# EAGLE design 1541-3d (EAGLE 6.6.0)
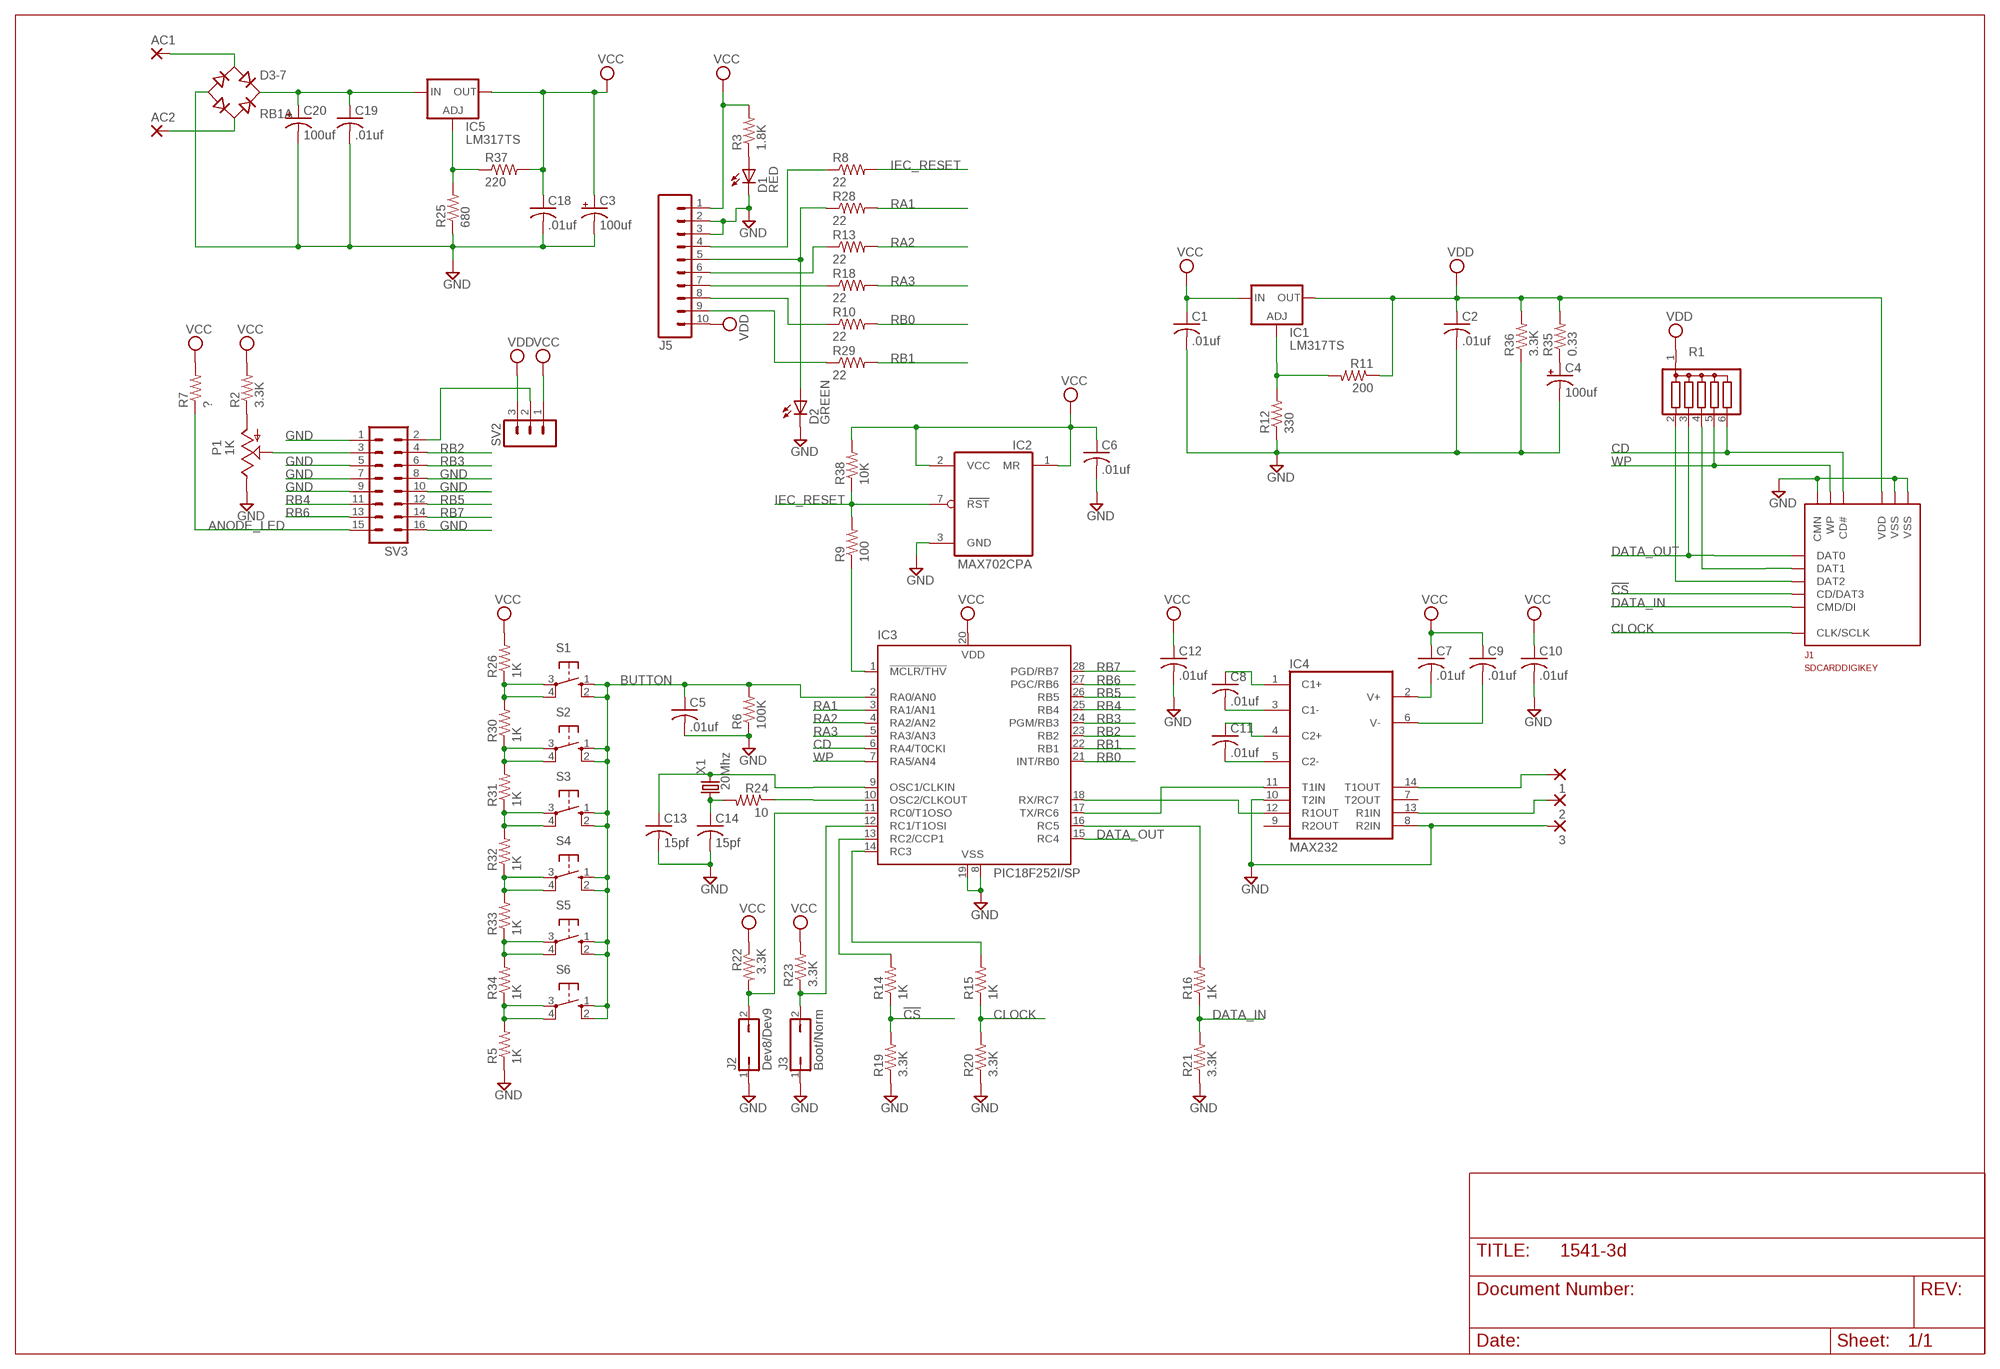
[diagram p0: schematic, sheet 1]

## Parts
1  2,15/1,0  [2,15/1,0]
2  2,15/1,0  [2,15/1,0]
3  2,15/1,0  [2,15/1,0]
AC1  2,15/1,0  [2,15/1,0]
AC2  2,15/1,0  [2,15/1,0]
C1  .01uf  C-US025-024X044  [C025-024X044]
C2  .01uf  C-US025-024X044  [C025-024X044]
C3  100uf  CPOL-USE2-5  [E2-5]
C4  100uf  CPOL-USE2-5  [E2-5]
C5  .01uf  C-US025-024X044  [C025-024X044]
C6  .01uf  C-US025-024X044  [C025-024X044]
C7  .01uf  C-US025-024X044  [C025-024X044]
C8  .01uf  C-US025-024X044  [C025-024X044]
C9  .01uf  C-US025-024X044  [C025-024X044]
C10  .01uf  C-US025-024X044  [C025-024X044]
C11  .01uf  C-US025-024X044  [C025-024X044]
C12  .01uf  C-US025-024X044  [C025-024X044]
C13  15pf  C-US025-024X044  [C025-024X044]
C14  15pf  C-US025-024X044  [C025-024X044]
C18  .01uf  C-US025-024X044  [C025-024X044]
C19  .01uf  C-US025-024X044  [C025-024X044]
C20  100uf  CPOL-USE2-5  [E2-5]
D1  RED  LED3MM  [LED3MM]
D2  GREEN  LED3MM  [LED3MM]
D3-7  RB1A  [RB1A]
IC1  LM317TS  [317TS]
IC2  MAX702CPA  [DIL08]
IC3  PIC18F252I/SP  PIC16F870P  [DIL28-3]
IC4  MAX232  [DIL16]
IC5  LM317TS  [317TS]
J1  SDCARDDIGIKEY  [WM24032]
J2  Dev8/Dev9  JP1Q  [JP1]
J3  Boot/Norm  JP1Q  [JP1]
J5  M10  [10P]
P1  1K  TRIM_US-LI10  [LI10]
R1  G05R  [SIL6]
R2  3.3K  R-US_0207/2V  [0207/2V]
R3  1.8K  R-US_0207/2V  [0207/2V]
R5  1K  R-US_0207/2V  [0207/2V]
R6  100K  R-US_0207/2V  [0207/2V]
R7  ?  R-US_0207/2V  [0207/2V]
R8  22  R-US_0207/2V  [0207/2V]
R9  100  R-US_0207/2V  [0207/2V]
R10  22  R-US_0207/2V  [0207/2V]
R11  200  R-US_0207/2V  [0207/2V]
R12  330  R-US_0207/2V  [0207/2V]
R13  22  R-US_0207/2V  [0207/2V]
R14  1K  R-US_0207/2V  [0207/2V]
R15  1K  R-US_0207/2V  [0207/2V]
R16  1K  R-US_0207/2V  [0207/2V]
R18  22  R-US_0207/2V  [0207/2V]
R19  3.3K  R-US_0207/2V  [0207/2V]
R20  3.3K  R-US_0207/2V  [0207/2V]
R21  3.3K  R-US_0207/2V  [0207/2V]
R22  3.3K  R-US_0207/2V  [0207/2V]
R23  3.3K  R-US_0207/2V  [0207/2V]
R24  10  R-US_0207/2V  [0207/2V]
R25  680  R-US_0207/2V  [0207/2V]
R26  1K  R-US_0207/2V  [0207/2V]
R28  22  R-US_0207/2V  [0207/2V]
R29  22  R-US_0207/2V  [0207/2V]
R30  1K  R-US_0207/2V  [0207/2V]
R31  1K  R-US_0207/2V  [0207/2V]
R32  1K  R-US_0207/2V  [0207/2V]
R33  1K  R-US_0207/2V  [0207/2V]
R34  1K  R-US_0207/2V  [0207/2V]
R35  0.33  R-US_0207/2V  [0207/2V]
R36  3.3K  R-US_0207/2V  [0207/2V]
R37  220  R-US_0207/2V  [0207/2V]
R38  10K  R-US_0207/2V  [0207/2V]
S1  10-XX  [B3F-10XX]
S2  10-XX  [B3F-10XX]
S3  10-XX  [B3F-10XX]
S4  10-XX  [B3F-10XX]
S5  10-XX  [B3F-10XX]
S6  10-XX  [B3F-10XX]
SV2  MA03-1  [MA03-1]
SV3  ML16  [ML16]
X1  20Mhz  CRYSTALHC49U70  [HC49U70]

## Nets
!CS: J1.1(CD/DAT3) R14.1 R19.2
ANODE_LED: R7.1 SV3.15
BUTTON: C5.1 IC3.2(RA0/AN0) R6.2 S1.1(S) S1.2(S1) S2.1(S) S2.2(S1) S3.1(S) S3.2(S1) S4.1(S) S4.2(S1) S5.1(S) S5.2(S1) S6.1(S) S6.2(S1)
CD: IC3.6(RA4/T0CKI) J1.CD(CD#) R1.6
CLOCK: J1.5(CLK/SCLK) R15.1 R20.2
DATA_IN: J1.2(CMD/DI) R16.1 R21.2
DATA_OUT: IC3.15(RC4) J1.7(DAT0) R1.3
GND: 3.1(P) C1.2 C2.2 C3.- C4.- C5.2 C6.2 C10.2 C12.2 C13.2 C14.2 C18.2 C19.2 C20.- D1.K(C) D2.K(C) D3-7.- IC2.3(GND) IC3.8(VSS) IC3.19(VSS) IC4.8(R2IN) IC4.10(T2IN) J1.3(VSS) J1.6(VSS) J1.CMN J2.1 J3.1 J5.2 J5.3 P1.E R5.1 R6.1 R12.1 R19.1 R20.1 R21.1 R25.1 R36.1 SV3.1 SV3.5 SV3.7 SV3.8 SV3.9 SV3.10 SV3.16
IEC_RESET: IC2.7(RST) R8.2 R9.2 R38.1
N$1: C4.+ R35.1
N$2: J1.9(DAT2) R1.2
N$3: J1.8(DAT1) R1.4
N$4: J5.9 R29.1
N$5: J5.8 R10.1
N$6: J5.7 R18.1
N$7: J5.4 R8.1
N$8: D2.A J5.5 R28.1
N$9: J5.6 R13.1
N$10: D1.A R3.1
N$11: IC3.18(RX/RC7) IC4.12(R1OUT)
N$12: IC3.14(RC3) R15.2
N$13: C14.1 R24.2 X1.1
N$14: IC3.1(!MCLR/THV) R9.1
N$15: C11.1 IC4.4(C2+)
N$16: C11.2 IC4.5(C2-)
N$17: C8.2 IC4.3(C1-)
N$18: C8.1 IC4.1(C1+)
N$19: C7.2 IC4.2(V+)
N$20: C13.1 IC3.9(OSC1/CLKIN) X1.2
N$21: IC3.10(OSC2/CLKOUT) R24.1
N$22: IC3.12(RC1/T1OSI) J3.2 R23.1
N$23: IC3.11(RC0/T1OSO) J2.2 R22.2
N$24: IC3.13(RC2/CCP1) R14.2
N$25: IC3.16(RC5) R16.2
N$26: IC1.1(ADJ) R11.2 R12.2
N$27: IC3.17(TX/RC6) IC4.11(T1IN)
N$28: R26.1 R30.2 S1.3(P) S1.4(P1)
N$29: R30.1 R31.2 S2.3(P) S2.4(P1)
N$30: R31.1 R32.2 S3.3(P) S3.4(P1)
N$31: R5.2 R34.1 S6.3(P) S6.4(P1)
N$32: R33.1 R34.2 S5.3(P) S5.4(P1)
N$33: R32.1 R33.2 S4.3(P) S4.4(P1)
N$34: P1.A R2.1
N$35: SV2.2 SV3.2
N$36: P1.S SV3.3
N$37: C9.2 IC4.6(V-)
N$38: IC5.1(ADJ) R25.2 R37.1
N$39: AC1.1(P) D3-7.AC1
N$40: C19.1 C20.+ D3-7.+ IC5.3(IN)
N$41: AC2.1(P) D3-7.AC2
N$42: 2.1(P) IC4.13(R1IN)
N$43: 1.1(P) IC4.14(T1OUT)
RA1: IC3.3(RA1/AN1) R28.2
RA2: IC3.4(RA2/AN2) R13.2
RA3: IC3.5(RA3/AN3) R18.2
RB0: IC3.21(INT/RB0) R10.2
RB1: IC3.22(RB1) R29.2
RB2: IC3.23(RB2) SV3.4
RB3: IC3.24(PGM/RB3) SV3.6
RB4: IC3.25(RB4) SV3.11
RB5: IC3.26(RB5) SV3.12
RB6: IC3.27(PGC/RB6) SV3.13
RB7: IC3.28(PGD/RB7) SV3.14
VCC: C1.1 C3.+ C6.1 C7.1 C9.1 C10.1 C12.1 C18.1 IC1.3(IN) IC2.1(MR) IC2.2(VCC) IC3.20(VDD) IC5.2(OUT) J5.1 R2.2 R3.2 R7.2 R22.1 R23.2 R26.2 R37.2 R38.2 SV2.1
VDD: C2.1 IC1.2(OUT) J1.4(VDD) J5.10 R1.1 R11.1 R35.2 R36.2 SV2.3
WP: IC3.7(RA5/AN4) J1.WP R1.5
Unconnected: IC4.7(T2OUT) IC4.9(R2OUT)

## Power pins joined to a net without a drawn wire
GND: IC4.15(GND) J1.A1(GND) J1.A2(GND)
VCC: IC4.16(VCC)

## Library data of the parts
1-3 AC1 AC2 = wirepad:2,15/1,0: THROUGH-HOLE PAD
C1 C2 C5-C14 C18 C19 = rcl:C-US: CAPACITOR, American symbol
C3 C4 C20 = rcl:CPOL-US: POLARIZED CAPACITOR, American symbol
D1 D2 = led:LED: LED OSRAM: - CHIPLED LG R971, LG N971, LY N971, LG Q971, LY Q971, LO R971, LY R971 LH N974, LH R974 LS Q976, LO Q976, LY Q976 LO Q996 - Hyper CHIPLED LW Q18S LB Q993, LB Q99A, LB R99A - SideLED LS A670, LO A670, LY A670, LG A670, LP A670 LB A673, LV A673, LT A673, LW A673 LH A674 LY A675 LS A676, LA A676, LO A676, LY A676, LW A676 LS A679, LY A679, LG A679 - Hyper Micro SIDELED® LS Y876, LA Y876, LO Y876, LY Y876 LT Y87S - SmartLED LW L88C, LW L88S LB L89C, LB L89S, LG L890 LS L89K, LO L89K, LY L89K LS L896, LA L896, LO L896, LY L896 - TOPLED LS T670, LO T670, LY T670, LG T670, LP T670 LSG T670, LSP T670, LSY T670, LOP T670, LYG T670 LG T671, LOG T671, LSG T671 LB T673, LV T673, LT T673, LW T673 LH T674 LS T676, LA T676, LO T676, LY T676, LB T676, LH T676, LSB T676, LW T676 LB T67C, LV T67C, LT T67C, LS T67K, LO T67K, LY T67K, LW E67C LS E67B, LA E67B, LO E67B, LY E67B, LB E67C, LV E67C, LT E67C LW T67C LS T679, LY T679, LG T679 LS T770, LO T770, LY T770, LG T770, LP T770 LB T773, LV T773, LT T773, LW T773 LH T774 LS E675, LA E675, LY E675, LS T675 LS T776, LA T776, LO T776, LY T776, LB T776 LHGB T686 LT T68C, LB T68C - Hyper Mini TOPLED® LB M676 - Mini TOPLED Santana® LG M470 LS M47K, LO M47K, LY M47K Source: http://www.osram.convergy.de LUXEON: - LUMILED® LXK2-PW12-R00, LXK2-PW12-S00, LXK2-PW14-U00, LXK2-PW14-V00 LXK2-PM12-R00, LXK2-PM12-S00, LXK2-PM14-U00 LXK2-PE12-Q00, LXK2-PE12-R00, LXK2-PE12-S00, LXK2-PE14-T00, LXK2-PE14-U00 LXK2-PB12-K00, LXK2-PB12-L00, LXK2-PB12-M00, LXK2-PB14-N00, LXK2-PB14-P00, LXK2-PB14-Q00 LXK2-PR12-L00, LXK2-PR12-M00, LXK2-PR14-Q00, LXK2-PR14-R00 LXK2-PD12-Q00, LXK2-PD12-R00, LXK2-PD12-S00 LXK2-PH12-R00, LXK2-PH12-S00 LXK2-PL12-P00, LXK2-PL12-Q00, LXK2-PL12-R00 Source: www.luxeon.com KINGBRIGHT: KA-3528ASYC Source: www.kingbright.com
D3-7 = rectifier:RB1A: RECTIFIER 1 A
IC1 IC5 = v-reg:LM317TS: VOLTAGE REGULATOR
IC2 = maxim:MAX702CPA: POWER SUPPLY MONITOR; MF: MAXIM; MPN: MAX702CPA+; OC_FARNELL: 1188018; OC_NEWARK: 69K6744
IC3 = microchip:PIC16*870: MICROCONTROLLER flash type; MF: MICROCHIP; MPN: PIC16F870-I/SP; OC_FARNELL: 9760954; OC_NEWARK: 19C7275
IC4 = maxim:MAX232: RS232 TRANSCEIVER; MF: MAXIM; MPN: MAX232ACPE+; OC_FARNELL: 9723773; OC_NEWARK: 68K4544
J1 = sdcards:SDCARD: SD Card Holder
J2 J3 = jumper:JP1Q: JUMPER
J5 = con-amp-quick:M10: AMP QUICK CONNECTOR; OC_FARNELL: unknown; OC_NEWARK: unknown
P1 = pot:TRIM_US-: POTENTIOMETER
R1 = resistor-sil:G05R: SIL RESISTOR; OC_FARNELL: unknown; OC_NEWARK: unknown
R2 R3 R5-R16 R18-R26 R28-R38 = rcl:R-US_: RESISTOR, American symbol
S1-S6 = switch-omron:10-XX: OMRON SWITCH; MPN: B3F-1000; OC_FARNELL: 176432; OC_NEWARK: 36M3542
SV2 = con-lstb:MA03-1: PIN HEADER; OC_FARNELL: unknown; OC_NEWARK: unknown
SV3 = con-harting-ml:ML16: HARTING; OC_FARNELL: unknown; OC_NEWARK: unknown
X1 = crystal:CRYSTAL: CRYSTAL; OC_FARNELL: unknown; OC_NEWARK: unknown

## Board
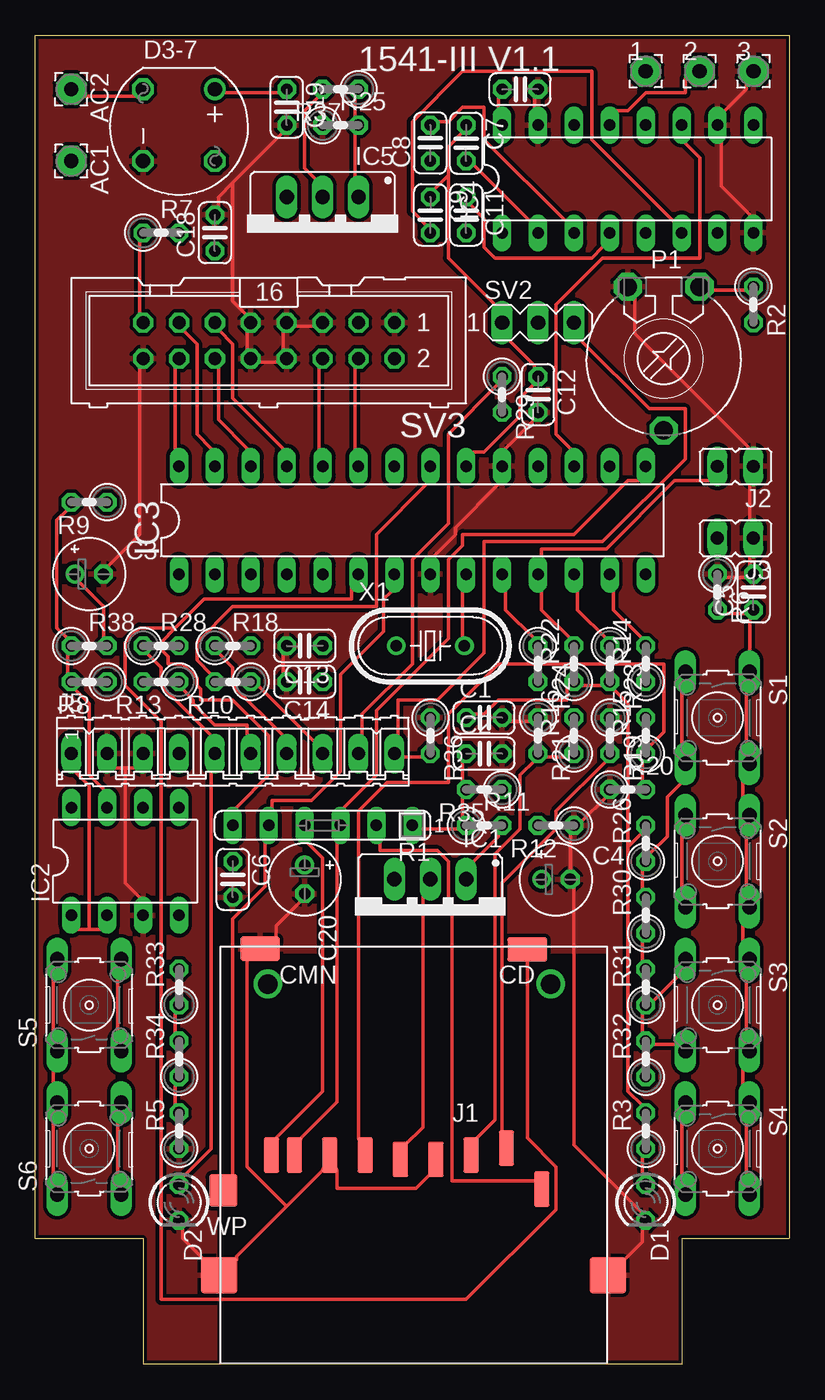
[diagram p1: board, top side]
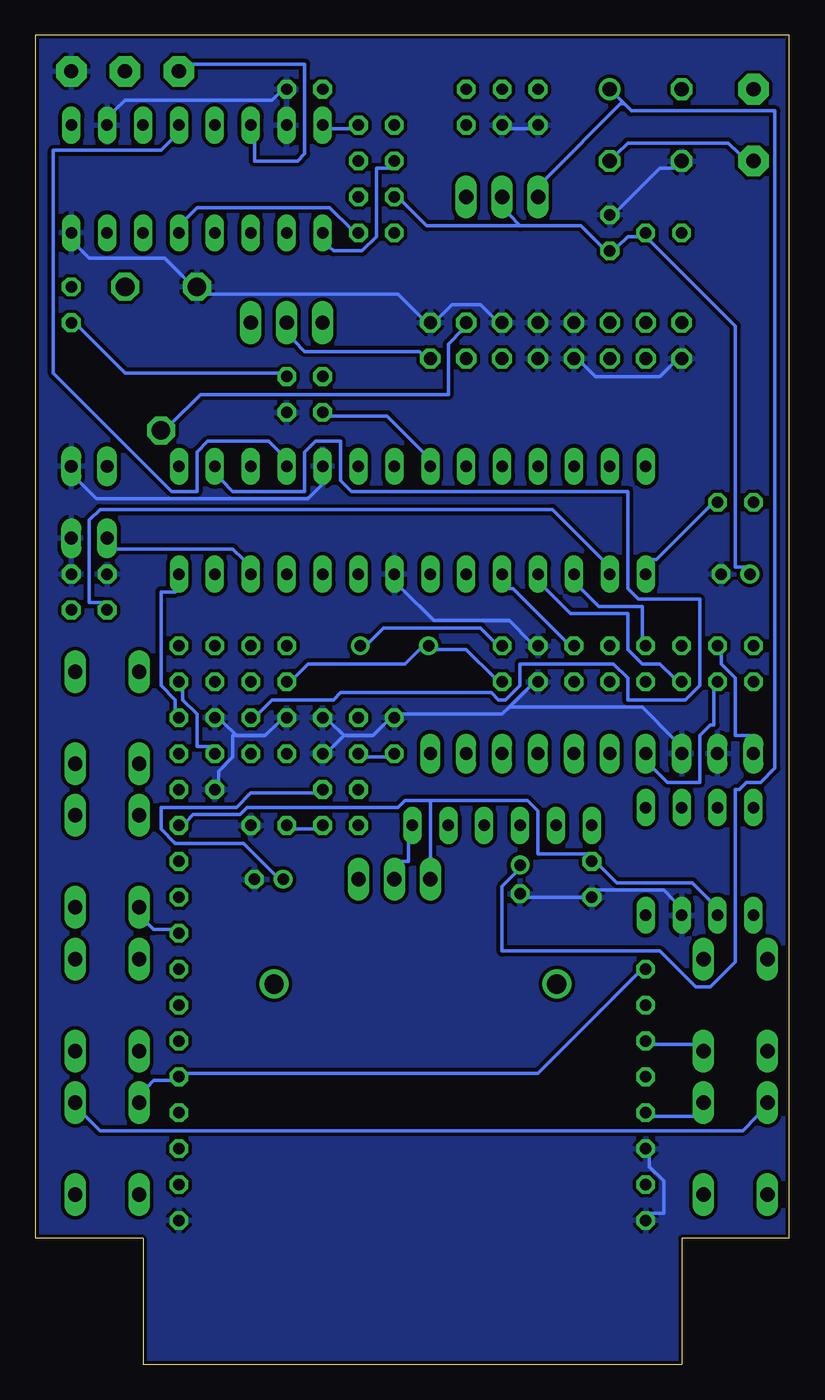
[diagram p2: board, bottom side, seen from below]

Size 53.34 x 93.98 mm. Coordinates in mm from the lower left corner, seen from the top.
Outline: 0,93.98 53.34,93.98 53.34,8.89 45.72,8.89 45.72,0 7.62,0 7.62,8.89 0,8.89 0,93.98
Copper layers (1*16): Top 0.035mm / dielectric 1.5mm / Bottom 0.035mm
Design rules "olimex10mil": minimum track width 10mil, minimum drill 24mil, track to track 10mil, track to pad 10mil, pad to pad 10mil, via to via 10mil, smd to smd 10mil, copper to edge 10mil, drill to drill 10mil, minimum pad ring 10mil, minimum via ring 8mil, stop-mask expansion 0mil, vias tented up to drill 0mil, thermal gap 10mil

### Footprints (pad centres in the part's own frame; a part is rotated, then mirrored left to right if it is on the bottom)
2,15/1,0 = drill 1.016 pad 2.159 octagon: 1 0,0
C025-024X044 = drill 0.813 octagon: 1 -1.27,0; 2 1.27,0
E2-5 = drill 0.813 pad 1.27: + -1.016,0 | drill 0.813 pad 1.27 octagon: - 1.016,0
LED3MM = drill 0.813 octagon: A -1.27,0; K 1.27,0
RB1A = drill 1.016: + -2.54,2.54 | drill 1.016 octagon: - 2.54,-2.54; AC1 2.54,2.54; AC2 -2.54,-2.54
317TS = drill 1.016 long: 1 -2.54,-2.54; 2 0,-2.54; 3 2.54,-2.54
DIL08 = drill 0.813 long: 1 -3.81,-3.81; 2 -1.27,-3.81; 3 1.27,-3.81; 4 3.81,-3.81; 5 3.81,3.81; 6 1.27,3.81; 7 -1.27,3.81; 8 -3.81,3.81
DIL28-3 = drill 0.813 long: 1 -16.51,-3.81; 2 -13.97,-3.81; 3 -11.43,-3.81; 4 -8.89,-3.81; 5 -6.35,-3.81; 6 -3.81,-3.81; 7 -1.27,-3.81; 8 1.27,-3.81; 9 3.81,-3.81; 10 6.35,-3.81; 11 8.89,-3.81; 12 11.43,-3.81; 13 13.97,-3.81; 14 16.51,-3.81; 15 16.51,3.81; 16 13.97,3.81; 17 11.43,3.81; 18 8.89,3.81; 19 6.35,3.81; 20 3.81,3.81; 21 1.27,3.81; 22 -1.27,3.81; 23 -3.81,3.81; 24 -6.35,3.81; 25 -8.89,3.81; 26 -11.43,3.81; 27 -13.97,3.81; 28 -16.51,3.81
DIL16 = drill 0.813 long: 1 -8.89,-3.81; 2 -6.35,-3.81; 3 -3.81,-3.81; 4 -1.27,-3.81; 5 1.27,-3.81; 6 3.81,-3.81; 7 6.35,-3.81; 8 8.89,-3.81; 9 8.89,3.81; 10 6.35,3.81; 11 3.81,3.81; 12 1.27,3.81; 13 -1.27,3.81; 14 -3.81,3.81; 15 -6.35,3.81; 16 -8.89,3.81
WM24032 = smd 1.1 x 2.5: 1 -6.975,-2.9; 2 -4.475,-2.4; 3 -1.975,-2.1; 4 0.525,-2.1; 5 3.025,-2.4; 6 5.525,-2.4; 7 8.025,-2.4; 8 9.65,-2.4; 9 -9.475,0 | smd 2.6 x 2.6: A1 -14.15,6.1; A2 13.35,6.1 | drill 1.36 pad 1.46: B1 -10.1,-14.5; B2 9.9,-14.5 | smd 2.8 x 1.7: CD -8.45,-16.95; CMN 10.45,-17 | smd 2 x 2.3: WP 13.05,0.1
JP1 = drill 0.914 long: 1 0,-1.27; 2 0,1.27
10P = drill 0.914 long: 1 -11.43,0; 2 -8.89,0; 3 -6.35,0; 4 -3.81,0; 5 -1.27,0; 6 1.27,0; 7 3.81,0; 8 6.35,0; 9 8.89,0; 10 11.43,0
LI10 = drill 1.321 octagon: A -2.54,-5.08; E 2.54,-5.08; S 0,5.08
SIL6 = drill 0.813 long: 1 -6.35,0; 2 -3.81,0; 3 -1.27,0; 4 1.27,0; 5 3.81,0; 6 6.35,0
0207/2V = drill 0.813 octagon: 1 -1.27,0; 2 1.27,0
B3F-10XX = drill 1.016 long: 1 -3.251,2.261; 2 3.251,2.261; 3 -3.251,-2.261; 4 3.251,-2.261
MA03-1 = drill 1.016 long: 1 -2.54,0; 2 0,0; 3 2.54,0
ML16 = drill 0.914 octagon: 1 -8.89,-1.27; 2 -8.89,1.27; 3 -6.35,-1.27; 4 -6.35,1.27; 5 -3.81,-1.27; 6 -3.81,1.27; 7 -1.27,-1.27; 8 -1.27,1.27; 9 1.27,-1.27; 10 1.27,1.27; 11 3.81,-1.27; 12 3.81,1.27; 13 6.35,-1.27; 14 6.35,1.27; 15 8.89,-1.27; 16 8.89,1.27
HC49U70 = drill 0.813: 1 -2.413,0; 2 2.413,0

### Placement (x,y rotation side)
1  43.18,91.44 0 top
2  46.99,91.44 0 top
3  50.8,91.44 0 top
AC1  2.54,85.09 270 top
AC2  2.54,90.17 270 top
C1  31.75,45.72 0 top
C2  31.75,43.18 0 top
C3  3.81,55.88 0 top
C4  36.83,34.29 0 top
C5  50.8,54.61 90 top
C6  13.97,34.29 270 top
C7  30.48,86.36 270 top
C8  27.94,86.36 90 top
C9  27.94,81.28 270 top
C10  34.29,90.17 0 top
C11  30.48,81.28 270 top
C12  35.56,68.58 270 top
C13  19.05,50.8 180 top
C14  19.05,48.26 180 top
C18  12.7,80.01 90 top
C19  17.78,88.9 270 top
C20  19.05,34.29 270 top
D1  43.18,11.43 270 top
D2  10.16,11.43 270 top
D3-7  10.16,87.63 270 top
IC1  27.94,31.75 180 top
IC2  6.35,35.56 0 top
IC3  26.67,59.69 0 top
IC4  41.91,83.82 0 top
IC5  20.32,80.01 180 top
J1  26.35,12.38 180 top
J2  49.53,63.5 90 top
J3  49.53,58.42 90 top
J5  13.97,43.18 0 top
P1  44.45,71.12 180 top
R1  20.32,38.1 180 top
R2  50.8,74.93 270 top
R3  43.18,16.51 90 top
R5  10.16,16.51 90 top
R6  48.26,54.61 270 top
R7  8.89,80.01 0 top
R8  3.81,48.26 180 top
R9  3.81,60.96 180 top
R10  13.97,48.26 180 top
R11  31.75,38.1 0 top
R12  36.83,38.1 180 top
R13  8.89,48.26 180 top
R14  43.18,49.53 90 top
R15  43.18,44.45 90 top
R16  38.1,44.45 90 top
R18  13.97,50.8 0 top
R19  40.64,44.45 270 top
R20  41.91,40.64 0 top
R21  35.56,44.45 270 top
R22  38.1,49.53 90 top
R23  40.64,49.53 270 top
R24  35.56,49.53 270 top
R25  21.59,87.63 0 top
R26  43.18,36.83 90 top
R28  8.89,50.8 0 top
R29  33.02,68.58 270 top
R30  43.18,31.75 90 top
R31  43.18,26.67 90 top
R32  43.18,21.59 90 top
R33  10.16,26.67 90 top
R34  10.16,21.59 90 top
R35  31.75,40.64 180 top
R36  27.94,44.45 270 top
R37  21.59,90.17 180 top
R38  3.81,50.8 0 top
S1  48.26,45.72 270 top
S2  48.26,35.56 270 top
S3  48.26,25.4 270 top
S4  48.26,15.24 270 top
S5  3.81,25.4 90 top
S6  3.81,15.24 90 top
SV2  35.56,73.66 0 top
SV3  16.51,72.39 180 top
X1  27.94,50.8 0 top

### Tracks (layer width: path | path; a pad name or v marks a point on that pad's centre or on a via)
!CS
  Top 0.254: J1.1 33.02,16.51 33.02,34.04 36.83,37.85 36.83,39.12 40.39,42.67 R19.2
  Bottom 0.254: R14.1 42.93,47.75 42.93,46.99 41.91,45.97 41.91,43.69 40.89,43.69 R19.2
ANODE_LED
  Top 0.254: R7.1 7.37,79.5 7.37,74.17 SV3.15
BUTTON
  Top 0.254: R6.2 48.77,53.09 50.29,53.09 C5.1 50.55,52.83 50.55,50.29 S1.1 50.29,47.5 50.29,43.94 S1.2 50.04,41.15 50.04,40.13 S2.1 50.29,37.34 50.29,33.78 S2.2 50.04,30.99 50.04,29.97 S3.1 50.29,27.18 50.29,23.62 S3.2 50.04,20.83 50.04,19.81 S4.1 50.29,17.02 50.29,13.46 S4.2 | S6.1 1.27,13.46 1.27,17.02 S6.2 1.27,19.81 1.27,20.83 S5.1 1.27,23.62 1.27,27.18 S5.2
  Bottom 0.254: IC3.2 13.21,56.9 16.76,60.45 48.77,60.45 49.53,59.69 49.53,53.85 48.51,53.85 R6.2 | S6.2 2.29,17.53 3.3,16.51 48.77,16.51 49.78,17.53 S4.1
CD
  Top 0.254: 9.91,52.07 11.94,54.1 22.35,54.1 22.35,54.86 IC3.6 | 9.91,52.07 8.89,51.05 8.89,50.55 9.4,50.04 9.4,49.53 10.41,49.53 11.43,48.51 11.43,48.01 11.68,47.75 11.68,46.99 13.97,46.99 16.51,44.45 16.51,41.66 14.22,39.37 R1.6 | 9.91,52.07 7.37,52.07 6.35,51.05 6.35,48.01 8.89,45.47 8.89,4.57 30.48,4.57 36.83,10.92 36.83,13.97 34.8,16 34.8,28.7 J1.CD
CLOCK
  Top 0.254: J1.5 22.86,16 22.86,39.12 24.89,41.15 29.21,41.15 29.21,45.97 32.77,49.53 44.45,49.53 44.45,44.7 43.43,43.69 R15.1 42.93,42.67 42.93,41.15 R20.2
DATA_IN
  Top 0.254: J1.2 31.24,16 32.51,17.27 32.51,36.07 34.29,37.85 34.29,41.66 35.31,42.67 R21.2 36.07,42.93 37.59,42.93 R16.1
DATA_OUT
  Top 0.254: J1.7 18.8,16 21.34,18.54 21.34,36.83 R1.3 21.84,39.37 24.13,41.66 24.13,46.23 29.21,51.31 29.21,56.9 30.23,57.91 30.23,58.67 38.1,58.67 41.91,62.48 42.67,62.48 IC3.15
GND
  Top 0.254: C3.- 5.08,56.39 7.37,58.67 7.37,70.61 SV3.16 | SV3.5 19.81,73.41 18.29,73.41 SV3.7 17.53,73.15 17.53,71.63 SV3.8 17.27,70.87 15.75,70.87 SV3.10 14.99,71.63 14.99,73.15 SV3.9 14.99,74.17 13.97,75.18 13.97,83.57 | 13.97,83.57 12.95,82.55 12.95,81.79 C18.2 | 13.97,83.57 17.53,87.12 C19.2 | R6.1 48.77,55.63 50.29,55.63 C5.2 50.55,56.39 50.55,57.15 J3.1 50.55,59.69 50.55,62.23 J2.1 50.55,64.77 42.42,72.9 42.42,75.44 P1.E | IC4.15 35.31,88.9 35.31,89.66 C10.2 | 3.1 50.29,90.42 50.29,90.17 48.77,88.65 IC4.10 48.51,86.36 48.51,83.31 50.55,81.28 IC4.8 | J1.3 27.94,13.46 26.92,12.45 21.34,12.45 21.34,13.72 J1.6 20.32,13.72 17.78,11.18 | D2.K 10.41,9.65 10.41,8.89 11.94,7.37 J1.A2 14.22,7.37 14.22,7.62 17.78,11.18 | C20.- 18.8,32.77 17.02,30.99 17.02,30.23 J1.CMN 14.99,28.7 14.99,13.97 17.78,11.18 | 6.35,42.16 7.11,42.16 J5.3 | 6.35,42.16 5.59,42.16 J5.2 | 6.35,42.16 6.35,34.04 7.37,33.02 IC2.3 | J1.A1 41.66,7.37 42.93,8.64 42.93,9.65 D1.K 42.93,10.67 38.1,15.49 38.1,33.78 C4.- 37.85,34.8 37.85,37.59 R12.1 38.61,38.35 40.39,40.13 R20.1 | IC3.8 28.19,57.15 29.72,58.67 29.72,59.18 32.77,62.23 IC3.19 33.27,64.77 35.31,66.8 C12.2 | C14.2 17.53,48.77 17.53,50.29 C13.2 | R21.1 35.05,45.47 33.53,45.47 C1.2
  Bottom 0.254: SV3.5 20.83,73.91 21.84,74.93 23.88,74.93 24.89,73.91 SV3.1 25.91,73.91 27.69,75.69 41.15,75.69 P1.E 42.67,76.71 44.2,78.23 49.53,78.23 50.29,78.99 IC4.8 | C19.2 18.29,87.38 19.81,87.38 R25.1 | C18.2 12.19,81.53 9.14,84.58 8.13,84.58 D3-7.- | SV3.16 8.13,70.87 9.14,69.85 13.72,69.85 14.73,70.87 SV3.10 | C10.2 36.07,89.92 36.58,89.41 46.99,89.41 47.75,88.65 IC4.10 | R5.1 9.91,14.73 9.91,13.97 8.89,12.95 8.89,10.67 9.91,10.67 D2.K | IC2.3 8.13,32.77 8.89,33.53 13.72,33.53 C6.2 14.48,33.02 18.54,33.02 C20.- | 31.5,44.45 29.46,44.45 28.45,45.47 R36.1 27.43,45.97 20.32,45.97 19.81,46.48 | 31.5,44.45 32.51,45.47 C1.2 | 31.5,44.45 32.51,43.43 C2.2 | 39.12,44.45 40.13,45.47 R19.1 | 39.12,44.45 37.08,44.45 36.07,45.47 R21.1 | 19.81,46.48 18.29,48.01 C14.2 | IC3.8 27.43,54.86 25.15,52.58 19.81,52.58 18.29,51.05 C13.2 | 39.12,44.45 39.37,44.45 39.37,42.93 40.39,41.91 40.39,41.15 R20.1 | 19.81,46.48 10.41,46.48 8.13,44.2 J5.3 | J2.1 50.29,62.48 49.02,61.21 34.04,61.21 33.02,62.23 IC3.19
  pour Bottom: 0,0 53.34,0 53.34,93.98 0,93.98
  pour Top: 0,0 12.7,0 12.7,29.21 40.64,29.21 40.64,0 53.34,0 53.34,93.98 0,93.98
IEC_RESET
  Top 0.254: R9.2 2.29,60.45 1.52,59.69 1.52,52.07 2.29,51.31 R38.1 2.29,50.29 2.29,48.77 R8.2 2.79,47.75 3.81,46.74 3.81,41.66 4.83,40.64 IC2.7
N$1
  Bottom 0.254: C4.+ 36.32,34.54 38.61,36.83 43.43,36.83 44.45,37.85 44.45,39.37 39.12,39.37 38.1,40.39 33.53,40.39 R35.1
N$2
  Top 0.254: J1.9 35.31,12.95 29.46,12.95 29.46,32.77 29.21,33.02 29.21,35.56 28.45,36.32 24.38,36.32 24.38,36.83 R1.2
N$3
  Top 0.254: J1.8 17.02,16 20.32,19.3 20.32,35.81 19.3,36.83 R1.4
N$4
  Top 0.254: R29.1 32.77,69.34 29.21,65.79 29.21,59.44 26.67,56.9 26.67,49.53 23.11,45.97 23.11,44.45 J5.9
N$5
  Top 0.254: R10.1 15.75,48.01 19.81,43.94 J5.8
N$6
  Top 0.254: R18.1 12.95,50.29 13.97,49.28 13.97,48.01 17.53,44.45 J5.7
N$7
  Bottom 0.254: R8.1 5.33,47.75 5.33,45.21 5.59,45.21 6.35,44.45 6.35,41.15 8.64,41.15 9.65,42.16 J5.4
N$8
  Top 0.254: D2.A 10.41,13.21 12.45,15.24 12.45,41.91 J5.5 12.45,44.45 8.89,48.01 8.89,49.28 7.87,50.29 R28.1
N$9
  Top 0.254: R13.1 10.41,47.75 11.18,46.99 11.18,46.74 12.7,45.21 14.99,45.21 14.99,44.45 J5.6
N$10
  Top 0.254: D1.A 42.93,13.21 42.93,14.73 R3.1
N$11
  Bottom 0.254: IC3.18 36.07,64.52 36.83,65.28 41.15,65.28 41.91,64.52 41.91,61.72 43.69,61.72 52.07,70.1 52.07,85.85 44.45,85.85 43.69,86.61 IC4.12
N$12
  Bottom 0.254: R15.2 43.43,46.23 43.43,46.99 44.45,48.01 44.45,54.61 43.43,54.61 IC3.14
N$13
  Bottom 0.254: C14.1 20.83,48.51 22.86,50.55 24.89,50.55 X1.1 26.16,50.55 27.18,49.53 34.04,49.53 35.05,48.51 R24.2
N$14
  Bottom 0.254: R9.1 5.59,60.71 9.4,56.9 9.65,56.9 IC3.1
N$15
  Top 0.254: C11.1 30.73,82.04 31.75,81.03 31.75,78.99 32.51,78.23 39.37,78.23 40.13,78.99 IC4.4
N$16
  Bottom 0.254: C11.2 30.99,80.26 32.51,81.79 41.91,81.79 42.67,81.03 IC4.5
N$17
  Top 0.254: C8.2 28.45,87.88 29.21,87.88 30.23,88.9 31.75,88.9 31.75,86.61 37.59,80.77 IC4.3
N$18
  Bottom 0.254: IC4.1 32.51,78.99 32.26,78.74 30.23,78.74 29.21,79.76 29.21,84.58 28.19,84.58 C8.1
N$19
  Top 0.254: C7.2 30.99,84.84 35.05,80.77 IC4.2
N$20
  Top 0.254: IC3.9 30.23,54.61 30.23,51.31 X1.2
  Bottom 0.254: C13.1 20.83,51.05 21.84,52.07 28.7,52.07 29.72,51.05 X1.2
N$21
  Top 0.254: R24.1 35.31,51.31 33.27,53.34 33.27,54.61 IC3.10
N$22
  Top 0.254: R23.1 40.39,51.31 38.35,53.34 38.35,54.61 IC3.12
  Bottom 0.254: J3.2 47.75,57.66 39.37,57.66 38.61,56.9 IC3.12
N$23
  Top 0.254: R22.2 37.85,51.31 35.81,53.34 35.81,54.61 IC3.11 35.81,57.15 35.81,57.66 40.39,57.66 45.21,62.48 47.75,62.48 J2.2
N$24
  Top 0.254: R14.2 42.93,51.31 40.89,53.34 40.89,54.61 IC3.13
N$25
  Bottom 0.254: R16.2 37.59,45.97 36.58,46.99 32.26,46.99 31.75,47.5 21.08,47.5 20.57,46.99 20.07,46.99 19.05,48.01 19.05,49.53 12.45,49.53 11.43,48.51 11.43,46.99 7.37,46.99 6.35,48.01 6.35,54.1 10.67,54.1 11.43,54.86 11.43,61.72 30.99,61.72 31.75,62.48 31.75,65.28 33.53,65.28 34.29,64.52 34.29,61.72 39.37,61.72 40.13,62.48 IC3.16
N$26
  Top 0.254: IC1.1 30.99,35.56 32.77,37.34 32.77,37.59 R11.2
  Bottom 0.254: R11.2 33.53,37.85 35.05,37.85 R12.2
N$27
  Top 0.254: IC3.17 37.85,64.77 36.83,65.79 36.83,74.93 40.13,78.23 46.99,78.23 46.99,85.34 45.97,86.36 IC4.11
N$28
  Top 0.254: R30.2 42.93,33.53 42.93,35.05 R26.1 43.43,36.07 44.7,37.34 44.7,40.13 45.72,41.15 S1.4 45.72,43.94 45.72,47.5 S1.3
N$29
  Top 0.254: R31.2 42.93,28.45 42.93,29.97 R30.1 | S2.3 45.72,37.34 45.72,33.78 S2.4
  Bottom 0.254: S2.4 45.47,31.24 44.96,30.73 43.69,30.73 R30.1
N$30
  Top 0.254: S3.4 45.47,22.61 43.69,22.61 R32.2 42.93,23.37 42.93,24.89 R31.1 43.69,25.65 45.47,27.43 S3.3
N$31
  Top 0.254: R5.2 9.91,18.29 9.91,19.81 R34.1 | S6.3 5.84,13.46 5.84,17.02 S6.4
  Bottom 0.254: R5.2 9.65,17.53 6.6,17.53 S6.4
N$32
  Top 0.254: R34.2 9.91,23.37 9.91,24.89 R33.1 | S5.4 5.84,27.18 5.84,23.62 S5.3
  Bottom 0.254: S5.3 6.6,22.61 9.65,22.61 R34.2
N$33
  Top 0.254: S4.4 45.72,13.46 45.72,17.02 S4.3
  Bottom 0.254: R33.2 10.67,27.69 17.78,20.57 42.67,20.57 R32.1 43.69,20.07 44.96,20.07 45.47,19.56 S4.3
N$34
  Top 0.254: R2.1 50.29,75.95 47.75,75.95 P1.A
N$35
  Bottom 0.254: SV3.2 25.91,71.37 26.16,71.63 34.29,71.63 35.05,72.39 SV2.2
N$36
  Bottom 0.254: SV3.3 23.11,73.15 24.13,72.14 24.13,68.58 41.66,68.58 43.69,66.55 P1.S
N$37
  Top 0.254: C9.2 27.69,80.52 26.67,81.53 26.67,87.88 30.23,91.44 39.37,91.44 39.37,86.61 45.21,80.77 IC4.6
N$38
  Top 0.254: R37.1 22.61,89.66 22.61,88.14 R25.2 22.61,87.12 22.61,83.82 IC5.1
N$39
  Bottom 0.254: D3-7.AC1 12.19,85.6 11.43,86.36 4.32,86.36 3.56,85.6 AC1.1
N$40
  Top 0.254: C19.1 17.27,89.92 13.21,89.92 D3-7.+
  Bottom 0.254: 11.68,89.15 12.19,89.66 D3-7.+ | 11.68,89.15 11.18,88.65 1.02,88.65 1.02,42.16 2.03,41.15 3.05,41.15 3.56,40.64 3.81,40.64 3.81,28.45 5.59,26.67 6.6,26.67 9.14,29.21 20.32,29.21 20.32,33.78 19.3,34.8 C20.+ | 11.68,89.15 11.94,89.15 17.27,83.82 IC5.3
N$41
  Top 0.254: D3-7.AC2 7.11,89.66 3.56,89.66 AC2.1
N$42
  Top 0.254: IC4.13 41.15,88.65 41.91,88.65 43.18,89.92 45.97,89.92 45.97,90.93 2.1
N$43
  Bottom 0.254: IC4.14 37.85,86.36 37.85,85.09 34.8,85.09 34.29,85.6 34.29,91.95 42.16,91.95 1.1
RA1
  Bottom 0.254: R28.2 10.41,51.31 10.41,53.59 13.46,53.59 14.73,54.86 IC3.3
RA2
  Bottom 0.254: R13.2 8.13,48.51 9.14,49.53 10.41,49.53 11.43,50.55 11.43,53.09 15.49,53.09 17.27,54.86 IC3.4
RA3
  Bottom 0.254: R18.2 15.75,51.05 19.56,54.86 19.81,54.86 IC3.5
RB0
  Top 0.254: R10.2 12.45,48.77 11.43,49.78 11.43,51.05 13.97,53.59 24.13,53.59 24.13,58.67 27.69,62.23 IC3.21
RB1
  Bottom 0.254: IC3.22 25.91,64.52 28.45,67.06 32.51,67.06 R29.2
RB2
  Top 0.254: IC3.23 22.61,64.77 22.61,70.61 SV3.4
RB3
  Top 0.254: IC3.24 20.07,64.77 20.07,70.61 SV3.6
RB4
  Top 0.254: IC3.25 17.53,64.77 13.97,68.33 13.97,72.14 12.95,73.15 SV3.11
RB5
  Top 0.254: IC3.26 14.99,64.77 12.95,66.8 12.95,70.61 SV3.12
RB6
  Top 0.254: IC3.27 12.45,64.77 11.43,65.79 11.43,72.14 10.41,73.15 SV3.13
RB7
  Top 0.254: IC3.28 9.91,64.77 9.91,70.61 SV3.14
VCC
  Top 0.254: IC3.20 30.99,64.52 31.75,64.52 34.29,67.06 34.29,68.33 35.31,69.34 C12.1 35.31,70.36 35.31,70.61 33.53,72.39 SV2.1 32.51,74.93 29.21,78.23 29.21,84.07 | IC4.16 32.77,88.9 32.77,89.66 C10.1 | 29.21,84.07 28.19,83.06 C9.1 | 29.21,84.07 29.21,86.11 30.23,87.12 C7.1 | R37.2 20.07,89.66 19.05,88.65 19.05,84.58 19.81,83.82 IC5.2 | C1.1 30.99,45.97 31.75,45.97 32.77,46.99 37.59,46.99 37.59,48.01 R22.1 38.61,48.01 40.13,48.01 R23.2 40.89,47.75 41.91,46.74 41.91,36.58 | 41.91,36.58 41.91,19.3 42.93,18.29 R3.2 | 41.91,36.58 42.93,37.59 R26.2 | C3.+ 3.05,55.37 4.83,53.59 4.83,51.31 R38.2 | 3.81,30.73 4.57,30.73 IC2.2 | 3.81,30.73 3.05,30.73 IC2.1 | 3.81,30.73 3.81,40.89 2.79,41.91 J5.1
  Bottom 0.254: R2.2 50.29,73.41 46.99,70.1 36.07,70.1 C12.1 | IC4.16 32.51,87.38 30.99,87.38 C7.1 | 19.05,80.52 14.73,80.52 13.21,78.99 C18.1 12.19,78.99 11.43,79.76 10.67,79.76 R7.2 9.91,79.5 3.81,73.41 3.81,56.39 3.05,56.39 C3.+ | 19.05,80.52 19.81,81.28 IC5.2 | 19.05,80.52 25.65,80.52 27.43,82.3 C9.1 | IC2.2 5.59,32.77 6.86,34.04 12.19,34.04 13.46,35.31 C6.1 14.22,36.07 17.78,36.07 17.78,39.12 18.54,39.88 25.4,39.88 | 25.4,39.88 25.4,35.56 IC1.3 | R38.2 4.83,50.29 4.83,49.53 3.81,48.51 3.81,44.45 2.79,44.45 J5.1 | 25.4,39.88 27.18,39.88 27.69,39.37 38.35,39.37 38.86,38.86 42.16,38.86 42.67,38.35 R26.2
VDD
  Top 0.254: J1.4 26.16,15.49 27.43,16.76 27.43,33.02 IC1.2 | C2.1 30.23,42.67 30.23,41.15 R35.2 30.23,40.13 30.23,38.61 R11.1 29.97,37.85 27.18,37.85 R1.1 | R36.2 27.43,42.93 25.91,42.93 J5.10 25.65,44.45 25.65,46.99 28.45,46.99 31.75,50.29 31.75,58.17 40.13,58.17 45.97,64.01 45.97,67.56 43.43,67.56 38.61,72.39 SV2.3
  Bottom 0.254: R1.1 26.92,36.83 26.92,35.56 27.43,35.56 IC1.2 | C2.1 29.97,42.93 28.45,42.93 R36.2
WP
  Top 0.254: J1.WP 13.97,13.21 13.97,31.5 16.26,33.78 16.26,36.83 R1.5 16.76,39.37 16.76,39.88 19.56,39.88 21.59,41.91 21.59,48.77 24.64,51.82 24.64,54.1 25.15,54.61 IC3.7

### Text on the board
tPlace: 1541-III V1.1